# Altium schematic sheet Connectors.SchDoc
size A4; SheetNumber: 3; SheetTotal: 4
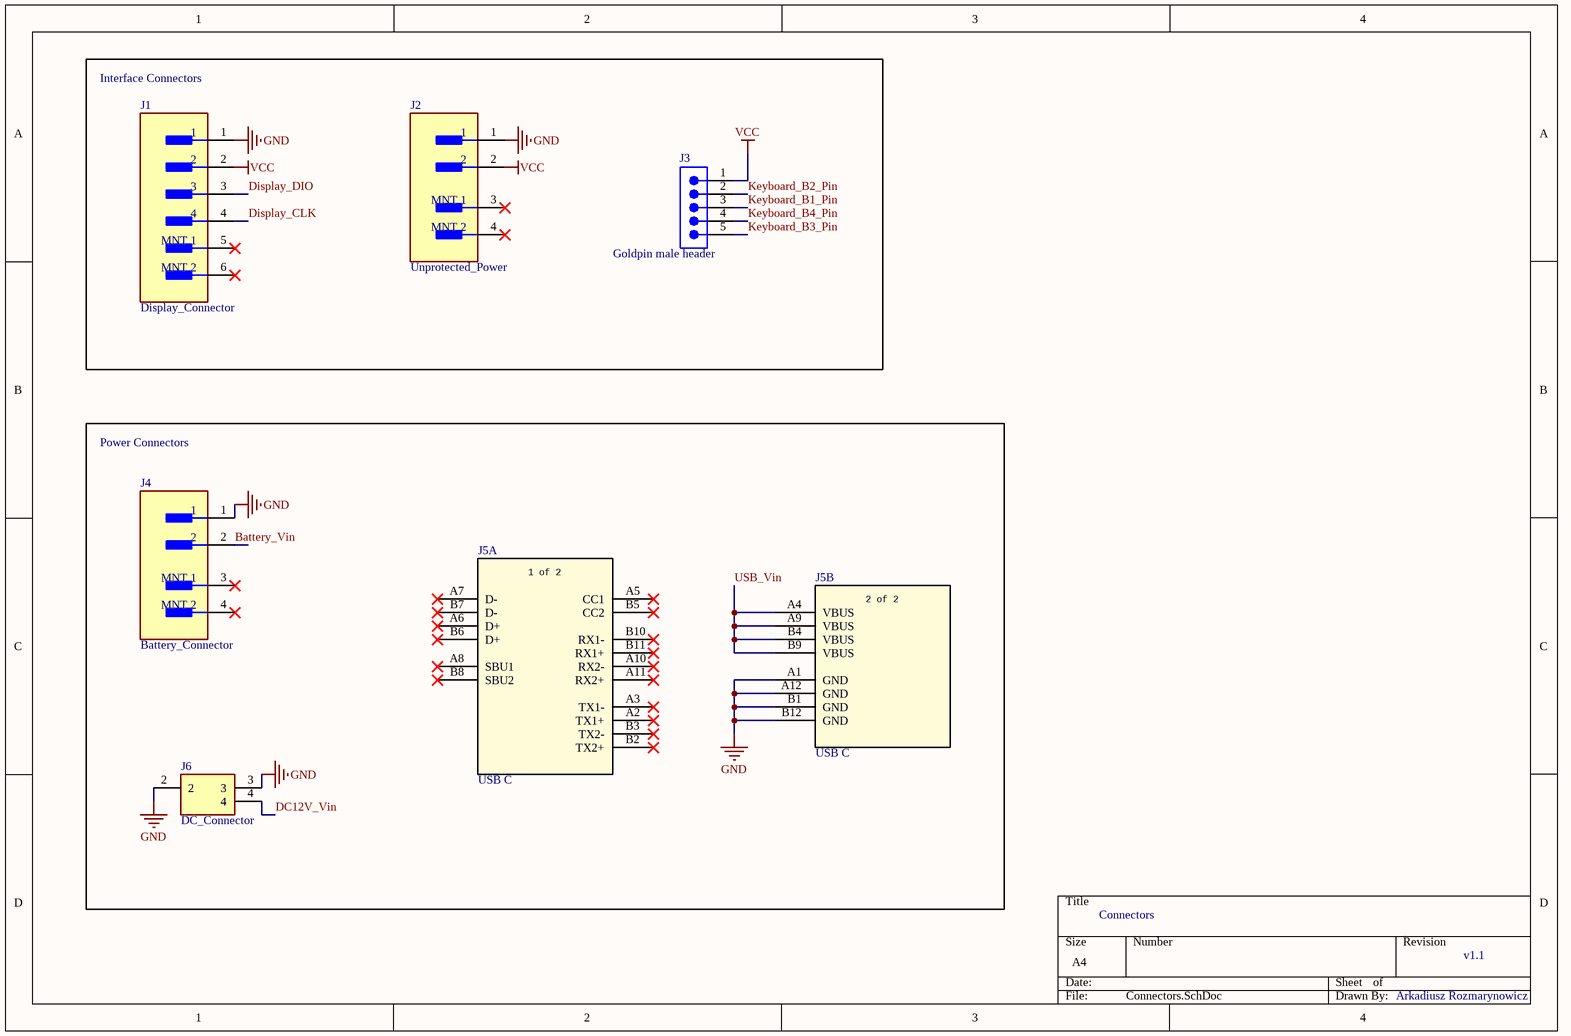
[diagram p0: Connectors.SchDoc]

## Parts
J1  Display_Connector  [FP-BM04B-GHS-TBT_LF_SN-MFG]
J2  Unprotected_Power  [FP-SM02B-GHS-TB_LF_SN-MFG]
J3  Goldpin male header  [SMTC-MTLW-105-05-X-S-190]
J4  Battery_Connector  [FP-SM02B-GHS-TB_LF_SN-MFG]
J5  USB C  [CONN_1054500101_MOL]  (parts A,B of 2)
J6  DC_Connector  [PCGK21]

## Blocks framed on the sheet
Interface Connectors: J1-J3
Power Connectors: J4-J6

## Nets
GND: J1.1 J2.1 J4.1 J5.A1(GND) J5.A12(GND) J5.B1(GND) J5.B12(GND) J6.2 J6.3
VCC: J1.2 J2.2 J3.1
Battery_Vin: J4.2
DC12V_Vin: J6.4
Display_CLK: J1.4
Display_DIO: J1.3
Keyboard_B1_Pin: J3.3
Keyboard_B2_Pin: J3.2
Keyboard_B3_Pin: J3.5
Keyboard_B4_Pin: J3.4
USB_Vin: J5.A4(VBUS) J5.A9(VBUS) J5.B4(VBUS) J5.B9(VBUS)

Not connected (* = marked no-connect by the designer): J1 5(MNT_1)* 6(MNT_2)*; J2 3(MNT_1)* 4(MNT_2)*; J4 3(MNT_1)* 4(MNT_2)*; J5 A2(TX1+)* A3(TX1-)* A5(CC1)* A6(D+)* A7(D-)* A8(SBU1)* A10(RX2-)* A11(RX2+)* B2(TX2+)* B3(TX2-)* B5(CC2)* B6(D+)* B7(D-)* B8(SBU2)* B10(RX1-)* B11(RX1+)*

## Notes on the sheet
- Connectors
- v1.1
- Arkadiusz Rozmarynowicz
- (in symbol 1054500101, part A) 1 of 2
- (in symbol 1054500101, part B) 2 of 2

## Library data of the parts
J1 = CMP-17439-000062-2: CONN HEADER SMD 4POS 1.25MM; Number of Positions: 4; Wire/Cable Gauge: 26AWG; Current Rating: 1A; Voltage Rating (AC): 50V; Gender: Male; Orientation: Straight; Max Operating Temperature: 85°C; Pitch: 1.25mm; Contact Plating: Tin; Number of Rows: 4; Series: GH; Min Operating Temperature: -25°C; REACH SVHC: No SVHC; Packaging: Cut Tape; Lead Free: Lead Free; Voltage Rating: 50V; Contact Material: Bronze; Number of Contacts: 4; Termination: Crimp; Case/Package: SMD/SMT; Housing Color: Natural; Housing Material: Nylon
J2 J4 = CMP-2000-07076-2: CONN HEADER SMD R/A 2POS 1.25MM; Voltage Rating: 50V; Number of Positions: 2; Pitch: 0.049inch; Current Rating: 1A; Connector Type: Outer Shroud Contact; Number of Rows: 1; Contact Material: Bronze; Termination: Solder; Color: Natural; Package Quantity: 2500; Mount: Surface Mount; Housing Color: Natural; Number of Contacts: 2; Packaging: Tape and Reel; Lead Free: Lead Free; Housing Material: Nylon; Orientation: Right Angle; Contact Type: Male Pin; Contact Plating: Tin; Series: GH; Fastening Type: Latch
J3 = CMP-1024-00077-1: Low Profile .025" SQ Post Header, Through-hole, Vertical, -55 to 105 degC, 2.54 mm Pitch, 5-Pin, Male, RoHS; Manufacturer: Samtec; PartNumber: MTLW-105-05-T-S-190; Pitch: 2.54 mm; RoHS: True; Temperature Range: -55 to 105 degC; Orientation: Vertical; ComponentLink1Description: Manufacturer URL; DatasheetVersion: F-214; ComponentLink3URL: http://www.samtec.com/documents/webfiles/cpdf/MTLW-1XX-XX-XX-X-XXX-XX-XX-MKT1.pdf; ComponentLink2URL: http://www.samtec.com/documents/webfiles/pdf/MTLW_TH.PDF; Mounting Technology: Through-hole; ComponentLink1URL: http://www.samtec.com; ComponentLink2Description: Datasheet; ComponentLink3Description: Package Specification; PackageVersion: T, 6/1991; PackageReference: MTLW-105-05-X-S-190; PackageDescription: Low Profile Terminal Assembly
J5 = 1054500101: Universal Serial Bus (USB) Shielded I/O Receptacle, Type C, Right-Angle, Top Mount, Surface Mount, 0.80mm Solder Tabs, Gold (Au) Flash over 0.76Âµm Palladium Nickel Plating; Manufacturer_Name: Molex; Copyright: Copyright (C) 2026 Ultra Librarian. All rights reserved.; Manufacturer_Part_Number: 1054500101; RefDes: RefDes; Type: Type
J6 = PC-GK2.1: Socket; DC supply; male; 5.5/2.1mm; 5.5mm; 2.1mm; THT; angled 90; Manufacturer_Name: Ninigi; Geometry.Height: 11.2mm; Manufacturer_Part_Number: PC-GK2.1; Mouser Part Number: *; Mouser Price/Stock: *; Arrow Part Number: *; Arrow Price/Stock: *; Datasheet Link: https://www.tme.eu/Document/78afd4fb8a41e4211137cd818ea9e93d/PC-GK21.jpg